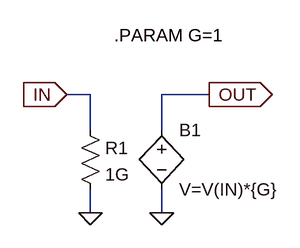
[diagram p0: schematic Z_gain.asc]
Z_gain.asc, the LTspice schematic file:
Version 4
SHEET 1 1188 680
WIRE 256 224 224 224
WIRE 416 224 352 224
WIRE 256 272 256 224
WIRE 352 272 352 224
WIRE 256 384 256 352
WIRE 352 384 352 352
FLAG 224 224 IN
IOPIN 224 224 In
FLAG 416 224 OUT
IOPIN 416 224 Out
FLAG 352 384 0
FLAG 256 384 0
SYMBOL bv 352 256 R0
SYMATTR InstName B1
SYMATTR Value V=V(IN)*{G}
SYMBOL res 240 256 R0
SYMATTR InstName R1
SYMATTR Value 1G
TEXT 288 144 Left 0 !.PARAM G=1

The netlist it stands for:
* Z_gain.asc
B1 OUT 0 V=V(IN)*{G}
R1 IN 0 1G
.PARAM G=1
.backanno
.end